# EAGLE design Sparkfun-SD-breakout (EAGLE 6.2)
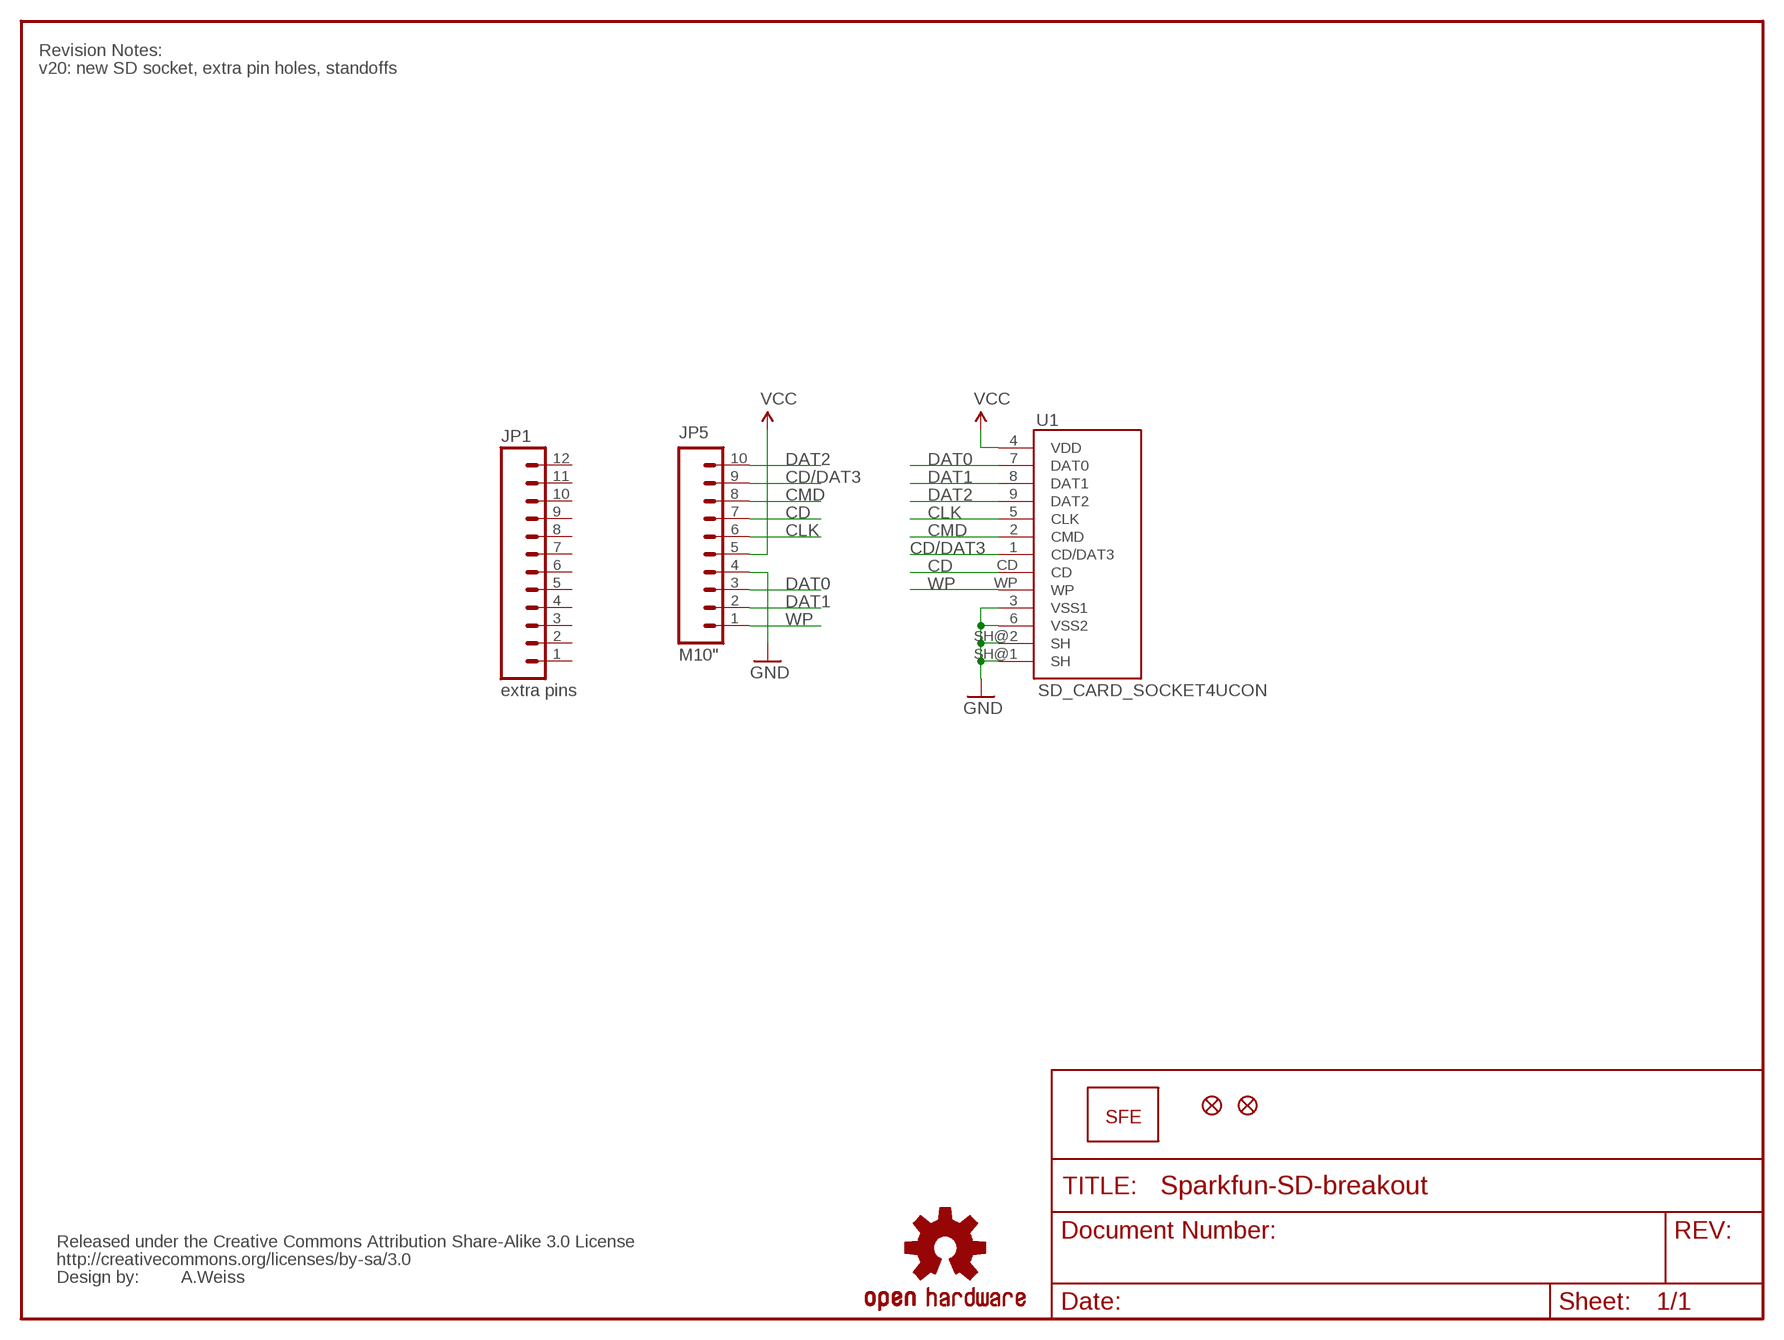
[diagram p0: schematic, sheet 1]

## Parts
JP1  M12POGOPIN_HOLES_ONLY  [1X12_HOLES_ONLY]
JP2  FIDUCIALUFIDUCIAL  [MICRO-FIDUCIAL]
JP3  FIDUCIALUFIDUCIAL  [MICRO-FIDUCIAL]
JP5  M10"  [1X10]
U1  SD_CARD_SOCKET4UCON  [SDCARD_4UCONN]
U$1  LOGO-SFENEW  [SFE-NEW-WEBLOGO]
U$2  CREATIVE_COMMONS  [CREATIVE_COMMONS]
U$3  OSHW-LOGOS  [OSHW-LOGO-S]

## Nets
CD: JP5.7 U1.CD
CD/DAT3: JP5.9 U1.1(CD/DAT3)
CLK: JP5.6 U1.5(CLK)
CMD: JP5.8 U1.2(CMD)
DAT0: JP5.3 U1.7(DAT0)
DAT1: JP5.2 U1.8(DAT1)
DAT2: JP5.10 U1.9(DAT2)
GND: JP5.4 U1.3(VSS1) U1.6(VSS2) U1.SH@1(SH) U1.SH@2(SH)
VCC: JP5.5 U1.4(VDD)
WP: JP5.1 U1.WP
Unconnected: JP1.1 JP1.2 JP1.3 JP1.4 JP1.5 JP1.6 JP1.7 JP1.8 JP1.9 JP1.10 JP1.11 JP1.12

## Notes on the sheet
- Revision Notes:
- v20: new SD socket, extra pin holes, standoffs
- extra pins
- A.Weiss

## Library data of the parts
JP1 = SparkFun-Connectors:M12: Header 12 Standard 12-pin 0.1" header. Use with straight break away headers (SKU : PRT-00116), right angle break away headers (PRT-00553), swiss pins (PRT-00743), machine pins (PRT-00117), and female headers (PRT-00115).
JP2 JP3 = SparkFun:FIDUCIAL: Fiducial Alignment Points Various fiducial points for machine vision alignment.
JP5 = SparkFun-Connectors:M10: Header 10 Standard 10-pin 0.1" header. Use with straight break away headers (SKU : PRT-00116), right angle break away headers (PRT-00553), swiss pins (PRT-00743), machine pins (PRT-00117), and female headers (PRT-00115).
U1 = SparkFun-Connectors:SD_CARD_SOCKET: SD Memory Card Connector, push-push normal type, CD enable, WP enable
U$1 = SparkFun:LOGO-SFE: Spark Fun Electronics PCB Logo This is the standard Spark Fun Electronics PCB logo.
U$2 = SparkFun-Aesthetics:CREATIVE_COMMONS: Creative Commons License summary
U$3 = SparkFun-Aesthetics:OSHW-LOGO: Open Source Hardware Logo This logo indicates the piece of hardware it is found on incorporates a OSHW license and/or adheres to the definition of open source hardware found here: http://freedomdefined.org/OSHW

## Board
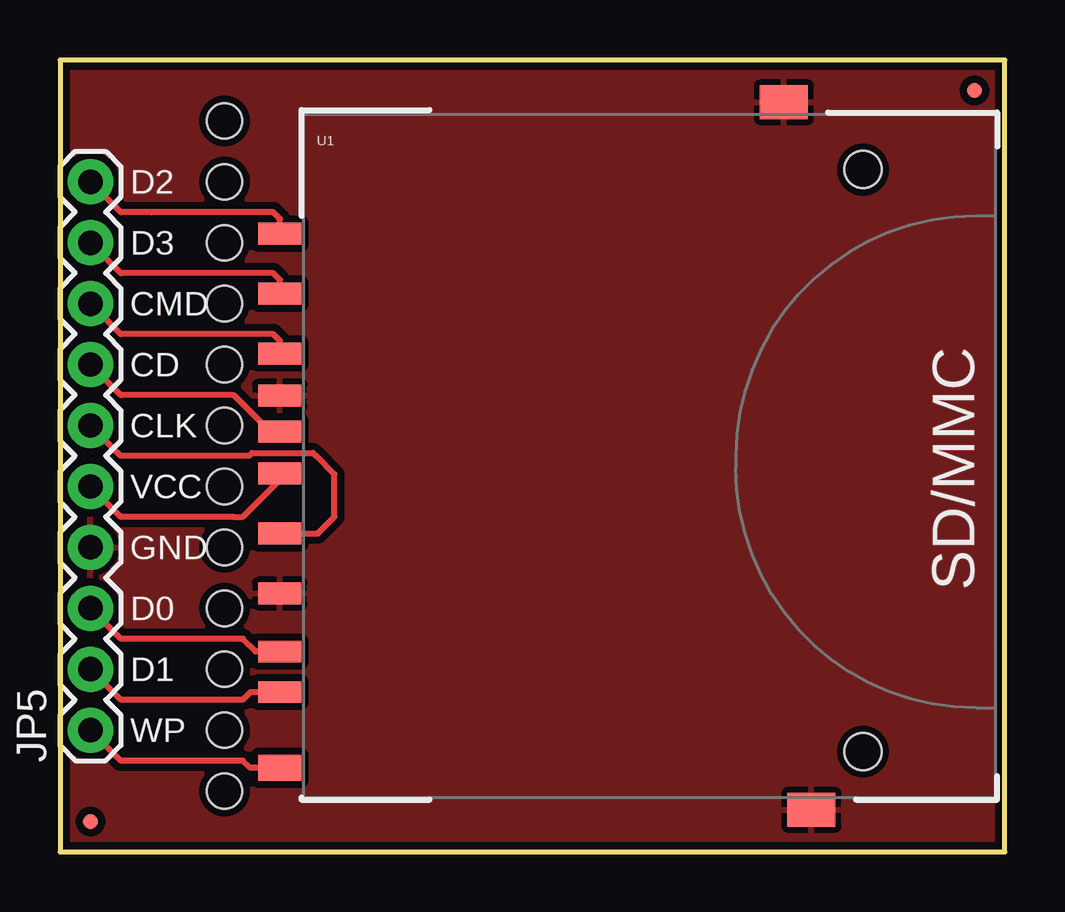
[diagram p1: board, top side]
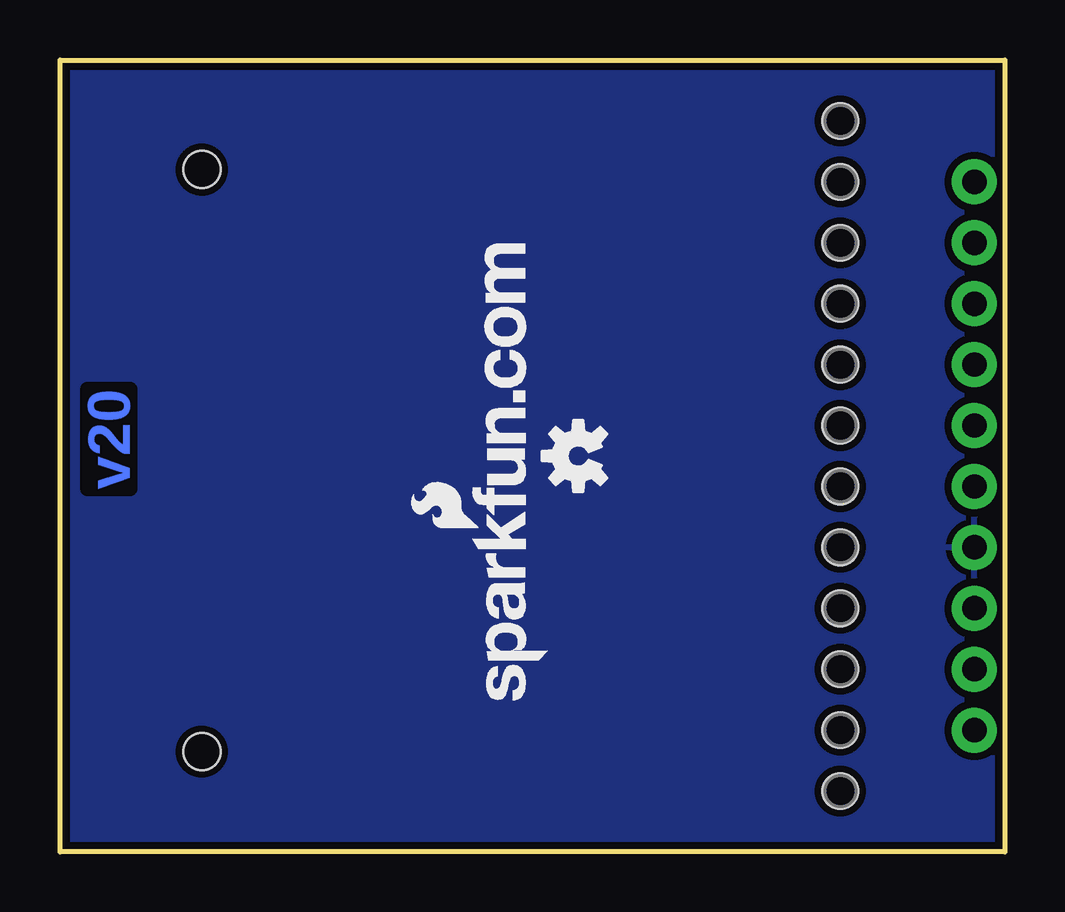
[diagram p2: board, bottom side, seen from below]

Size 39.37 x 33.02 mm. Coordinates in mm from the lower left corner, seen from the top.
Outline: 0,0 39.37,0 39.37,33.02 0,33.02 0,0
Copper layers (1*16): Top 0.0356mm / dielectric 1.5011mm / Bottom 0.0356mm
Design rules: minimum track width 8mil, minimum drill 20mil, track to track 8mil, track to pad 8mil, pad to pad 8mil, via to via 8mil, smd to smd 8mil, copper to edge 10mil, drill to drill 8mil, minimum pad ring 12mil, minimum via ring 10mil, stop-mask expansion 4mil, vias tented up to drill 20mil, thermal gap 10mil

### Footprints (pad centres in the part's own frame; a part is rotated, then mirrored left to right if it is on the bottom)
1X12_HOLES_ONLY = drill 0.889 pad 0.813: 1 0,0; 2 2.54,0; 3 5.08,0; 4 7.62,0; 5 10.16,0; 6 12.7,0; 7 15.24,0; 8 17.78,0; 9 20.32,0; 10 22.86,0; 11 25.4,0; 12 27.94,0 | hole 1.473: 0,0; 2.54,0; 5.08,0; 7.62,0; 10.16,0; 12.7,0; 15.24,0; 17.78,0; 20.32,0; 22.86,0; 25.4,0; 27.94,0
MICRO-FIDUCIAL = smd 0.635 x 0.635: 1 0,0
1X10 = drill 1.016 pad 1.88: 1 0,0; 2 2.54,0; 3 5.08,0; 4 7.62,0; 5 10.16,0; 6 12.7,0; 7 15.24,0; 8 17.78,0; 9 20.32,0; 10 22.86,0
SDCARD_4UCONN = smd 1.8 x 0.9: 1 -1,6.77; 2 -1,4.27; 3 -1,2.52; 4 -1,-0.73; 5 -1,-3.23; 6 -1,-5.73; 7 -1,-8.15; 8 -1,-9.85; 9 -1,9.27; CD -1,1.02 | smd 2 x 1.4: SH@1 20,14.75; SH@2 21.15,-14.75 | smd 1.8 x 1.1: WP -1,-13 | hole 1.55: 23.3,11.94; 23.3,-12.32

### Placement (x,y rotation side)
JP1  6.86,2.54 90 bottom
JP2  1.27,1.27 0 top
JP3  38.1,31.75 0 top
JP5  1.27,5.08 90 top
U1  10.16,16.51 0 top
U$1  19.05,6.32 90 bottom
U$2  19.05,-8.89 0 top  (outside the outline)
U$3  17.78,16.51 90 bottom

### Tracks (layer width: path | path; a pad name or v marks a point on that pad's centre or on a via)
CD
  Top 0.254: U1.CD 8.76,17.53 8.26,18.03 7.24,19.05 2.54,19.05 JP5.7
CD/DAT3
  Top 0.254: U1.1 9.16,23.86 8.89,24.13 2.54,24.13 JP5.9
CLK
  Top 0.254: U1.5 10.74,13.28 11.43,13.97 11.43,15.75 10.67,16.51 10.54,16.64 8,16.64 7.87,16.51 2.54,16.51 JP5.6
CMD
  Top 0.254: U1.2 9.16,21.32 8.89,21.59 2.54,21.59 JP5.8
DAT0
  Top 0.254: U1.7 8.15,8.36 7.62,8.89 2.54,8.89 JP5.3
DAT1
  Top 0.254: U1.8 7.93,6.66 7.62,6.35 2.54,6.35 JP5.2
DAT2
  Top 0.254: U1.9 9.16,26.4 8.89,26.67 3.81,26.67 2.54,26.67 JP5.10
GND
  pour Bottom (isolate 0.305): 0,33.02 0,0 39.37,0 39.37,33.02
  pour Top (isolate 0.305): 0,33.02 0,0 39.37,0 39.37,33.02
VCC
  Top 0.254: U1.4 9.16,15.51 8.38,14.73 7.62,13.97 7.24,13.97 2.54,13.97 JP5.5
WP
  Top 0.254: U1.WP 7.92,3.51 7.62,3.81 2.54,3.81 JP5.1

### Text on the board
Bottom: v20
tPlace: D2 | D3 | CMD | CD | CLK | VCC | GND | SD/MMC | D0 | D1 | WP